# EasyEDA Pro project EasyEDA_ChisFlash_V0.1_Pichu.epro

# Schematic ChisFlash-Pichu
Create Date: 2024-08-13; Page Name: P1; Project Name: GBA烧录卡; Schematic Name: ChisFlash-Prometheus_1; Update Date: 2024-08-13; Company: ChisBread/ChisFlash-Prometheus; Drawed: ChisBread; Page Size: A4; Reviewed: ChisBread; Version: 2
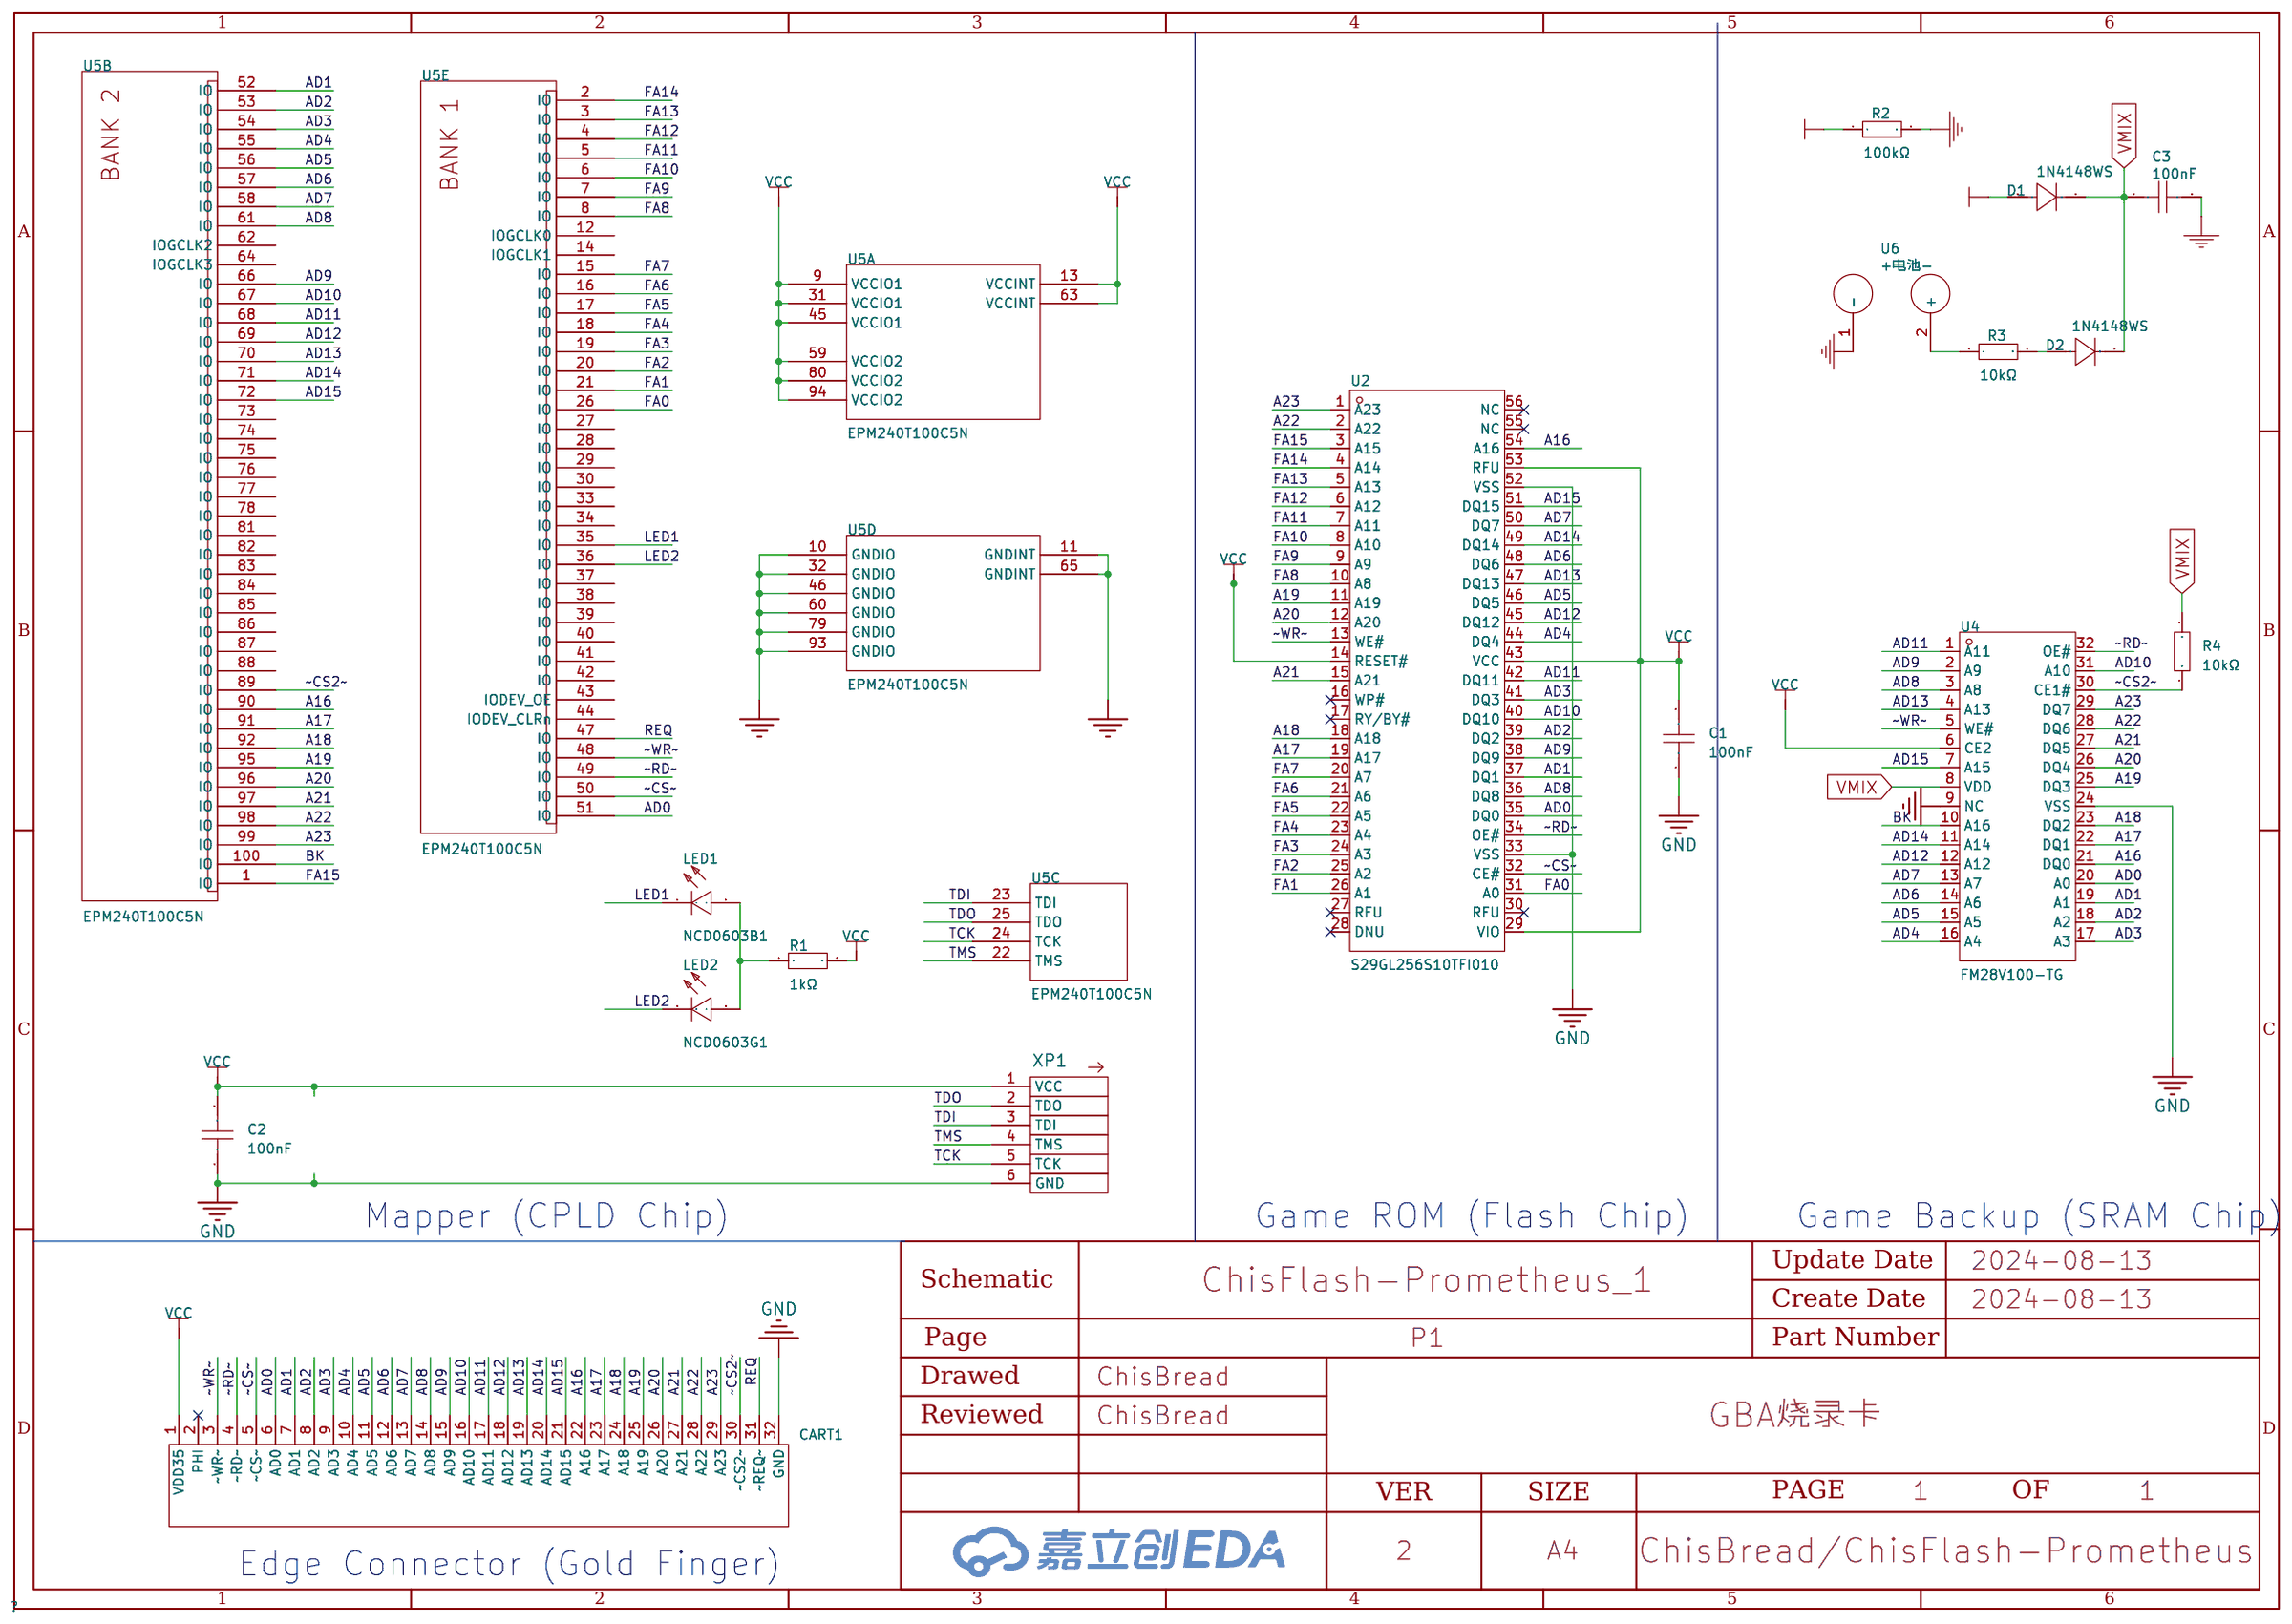
[diagram p0: schematic sheet]

## Parts
C1  100nF  [C0603]
C2  100nF  [C0603]
C3  100nF  [C0603]
CART1  -  [GBACartridge]  (no BOM)
D1  1N4148WS  [SOD-323_L1.8-W1.3-LS2.5-RD]
D2  1N4148WS  [SOD-323_L1.8-W1.3-LS2.5-RD]
LED1  NCD0603B1  [LED0603-RD]
LED2  NCD0603G1  [LED0603-RD]
R1  1kΩ  [R0603]
R2  100kΩ  [R0603]
R3  10kΩ  [R0603]
R4  10kΩ  [R0603]
U2  S29GL256S10TFI010  [TSOP-56_L18.4-W14.0-P0.50-LS20.0-TL]
U4  FM28V100-TG  [STSOP-32_L8.0-W11.8-P0.50-LS13.4-TL]
U5  EPM240T100C5N  [TQFP-100_L14.0-W14.0-P0.50-LS16.0-BL]  (sections 1,2,3,4,5)
U6  +电池-  [电池]
XP1  JTAG  [HDR-TH_6P-P1.27-V-M-1]  (no BOM)

## Library data of the parts
C1 C2 = CAP_0603: Supplier Footprint: 0603
C3 = CGA0603X7R104K500JT: 容值:100nF;精度:±10%;额定电压:50V;材质(温度系数):X7R;; LCSC Part Name: 100nF ±10% 50V; Supplier Part: C6119867; Manufacturer: HRE(芯声); Supplier Footprint: 0603; JLCPCB Part Class: Extended Part; Supplier: LCSC; Tolerance: ±10%; Voltage Rated: 50V; Temperature Coefficient: X7R
CART1 = GBACartridge: GBA Cartridge
D1 D2 = 1N4148WS_C917117: 二极管配置:独立式;正向压降(Vf):1.25V@150mA;直流反向耐压(Vr):100V;平均整流电流(Io):300mA;功率:400mW;反向恢复时间(trr):8ns;; LCSC Part Name: 电压:100V 电流:300mA; Supplier Part: C917117; Manufacturer: JSMSEMI(杰盛微); Supplier Footprint: SOD-323; JLCPCB Part Class: Extended Part; Datasheet: https://atta.szlcsc.com/upload/public/pdf/source/20230807/08D9F448A82EA88A23B325A669586A09.pdf; Supplier: LCSC; Diode Configuration: 独立式; Forward Voltage (Vf@If): 1.25V@150mA; Reverse Voltage (Vr): 100V; Average Rectified Current (Io): 300mA; Power Dissipation: 400mW; Reverse Leakage Current: 1uA@75V; Reverse Recovery Time (trr): 8ns; Operating Temperature: -55℃~+150℃@(Tj)
LED1 = NCD0603B1: 发光颜色:蓝色;正向电压(VF):2.6V~3.6V;功率:72mW;正向电流:10mA;主波长:463nm~475nm;透镜颜色:无色透明透镜;发光强度:80mcd~220mcd;发光角度:130°;工作温度:-30℃~+85℃;; Supplier Part: C84266; Manufacturer: 国星光电; Supplier Footprint: 0603; JLCPCB Part Class: 扩展库; Datasheet: https://atta.szlcsc.com/upload/public/pdf/source/20200820/C84266_6A3CDBEFA72C6CAD68EDA53474ADAE6C.pdf; Supplier: LCSC; Emitted Color: 蓝色; Forward Voltage (VF): 2.6V~3.6V; Power Dissipation: 72mW; Forward Current: 10mA; Dominant Wavelength: 463nm~475nm; Lens Color: 无色透明透镜; Luminous Intensity: 80mcd~220mcd; Viewing Angle: 130°; Operating Temperature: -30℃~+85℃
LED2 = NCD0603G1: 发光颜色:翠绿色;正向电压(VF):2.6V~3.6V;功率:72mW;正向电流:10mA;主波长:515nm~530nm;透镜颜色:无色透明透镜;发光强度:330mcd~900mcd;发光角度:130°;工作温度:-30℃~+85℃;; Supplier Part: C84267; Manufacturer: 国星光电; Supplier Footprint: 0603; JLCPCB Part Class: 扩展库; Datasheet: https://atta.szlcsc.com/upload/public/pdf/source/20200820/C84267_04BA7703640BAC111D09F5EFB971FBF3.pdf; Supplier: LCSC; Emitted Color: 翠绿色; Forward Voltage (VF): 2.6V~3.6V; Power Dissipation: 72mW; Forward Current: 10mA; Dominant Wavelength: 515nm~530nm; Lens Color: 无色透明透镜; Luminous Intensity: 330mcd~900mcd; Viewing Angle: 130°; Operating Temperature: -30℃~+85℃
R1 = 0603WAF1001T5E: 电阻类型:厚膜电阻;阻值:1kΩ;精度:±1%;功率:100mW;最大工作电压:75V;温度系数:±100ppm/℃;; LCSC Part Name: 1kΩ ±1% 100mW 厚膜电阻; Supplier Part: C21190; Manufacturer: UNI-ROYAL(厚声); Supplier Footprint: 0603; JLCPCB Part Class: 基础库; Datasheet: https://atta.szlcsc.com/upload/public/pdf/source/20200306/C422600_1E6D84923E4A46A82E41ADD87F860B5C.pdf; Supplier: LCSC; Type: 厚膜电阻; Tolerance: ±1%; Power(Watts): 100mW; Overload Voltage (Max): 75V; Temperature Coefficient: ±100ppm/℃; Operating Temperature Range: -55℃~+155℃
R2 = 0603WAF1003T5E: 电阻类型:厚膜电阻;阻值:100kΩ;精度:±1%;功率:100mW;最大工作电压:75V;温度系数:±100ppm/℃;; LCSC Part Name: 100kΩ ±1% 100mW 厚膜电阻; Supplier Part: C25803; Manufacturer: UNI-ROYAL(厚声); Supplier Footprint: 0603; JLCPCB Part Class: Basic Part; Datasheet: https://atta.szlcsc.com/upload/public/pdf/source/20200306/C422600_1E6D84923E4A46A82E41ADD87F860B5C.pdf; Supplier: LCSC; Type: 厚膜电阻; Tolerance: ±1%; Power(Watts): 100mW; Overload Voltage (Max): 75V; Temperature Coefficient: ±100ppm/℃; Operating Temperature Range: -55℃~+155℃; Resistance: 47K
R3 R4 = 0603WAF1002T5E: 电阻类型:厚膜电阻;阻值:10kΩ;精度:±1%;功率:100mW;最大工作电压:75V;温度系数:±100ppm/℃;; LCSC Part Name: 厚膜电阻 10kΩ ±1% 100mW; Supplier Part: C25804; Manufacturer: UNI-ROYAL(厚声); Supplier Footprint: 0603; JLCPCB Part Class: Basic Part; Datasheet: https://atta.szlcsc.com/upload/public/pdf/source/20200306/C422600_1E6D84923E4A46A82E41ADD87F860B5C.pdf; Supplier: LCSC; Type: 厚膜电阻; Tolerance: ±1%; Power(Watts): 100mW; Overload Voltage (Max): 75V; Temperature Coefficient: ±100ppm/℃; Operating Temperature Range: -55℃~+155℃; Resistance: 47K
U2 = S29GL256S10TFI010: Supplier Part: C1350995; Manufacturer: SPANSION(飞索); Supplier Footprint: TSOP-56; JLCPCB Part Class: Extended Part; Datasheet: https://atta.szlcsc.com/upload/public/pdf/source/20201109/C914940_4A5E28132C9BE0EE19A790F58F84C86D.pdf; Supplier: LCSC
U4 = FM28V100-TG: Supplier Part: C2959453; Manufacturer: CYPRESS(赛普拉斯); Supplier Footprint: TFSOP-32; JLCPCB Part Class: 扩展库; Datasheet: https://atta.szlcsc.com/upload/public/pdf/source/20210608/2F2AEFEDCE558E0D37969C616959BD3C.pdf; Supplier: LCSC
U5 = EPM240T100C5N: 类型:其它PLD;逻辑门数量:-;逻辑单元数:-;逻辑阵列块数:240;; Supplier Part: C10041; Manufacturer: Intel/Altera; Supplier Footprint: TQFP-100(14x14); JLCPCB Part Class: 扩展库; Datasheet: https://atta.szlcsc.com/upload/public/pdf/source/20121123/1457706563537.pdf; Supplier: LCSC; Type: 其它PLD; Supply Voltage Range - VCCIO: 3.3V；2.5V; Logic Array Blocks: 240; Maximum Delay Time Tpd: 4.7ns; Operating Temperature Range: 0℃~+85℃
U6 = +电池-
XP1 = jtag

## Nets
GND: C1.1 C2.1 C3.2 CART1.32(GND) R2.2 U2.33(VSS) U2.52(VSS) U4.9(NC) U4.24(VSS) U5.10(GNDIO) U5.11(GNDINT) U5.32(GNDIO) U5.46(GNDIO) U5.60(GNDIO) U5.65(GNDINT) U5.79(GNDIO) U5.93(GNDIO) U6.1(-) XP1.6(GND)
VCC: C1.2 C2.2 CART1.1(VDD35) D1.2(A) R1.2 R2.1 U2.14(RESET#) U2.29(VIO) U2.43(VCC) U2.53(RFU) U4.6(CE2) U5.9(VCCIO1) U5.13(VCCINT) U5.31(VCCIO1) U5.45(VCCIO1) U5.59(VCCIO2) U5.63(VCCINT) U5.80(VCCIO2) U5.94(VCCIO2) XP1.1(VCC)
A16: CART1.22(A16) U2.54(A16) U4.21(DQ0) U5.90(IO)
A17: CART1.23(A17) U2.19(A17) U4.22(DQ1) U5.91(IO)
A18: CART1.24(A18) U2.18(A18) U4.23(DQ2) U5.92(IO)
A19: CART1.25(A19) U2.11(A19) U4.25(DQ3) U5.95(IO)
A20: CART1.26(A20) U2.12(A20) U4.26(DQ4) U5.96(IO)
A21: CART1.27(A21) U2.15(A21) U4.27(DQ5) U5.97(IO)
A22: CART1.28(A22) U2.2(A22) U4.28(DQ6) U5.98(IO)
A23: CART1.29(A23) U2.1(A23) U4.29(DQ7) U5.99(IO)
AD0: CART1.6(AD0) U2.35(DQ0) U4.20(A0) U5.51(IO)
AD1: CART1.7(AD1) U2.37(DQ1) U4.19(A1) U5.52(IO)
AD2: CART1.8(AD2) U2.39(DQ2) U4.18(A2) U5.53(IO)
AD3: CART1.9(AD3) U2.41(DQ3) U4.17(A3) U5.54(IO)
AD4: CART1.10(AD4) U2.44(DQ4) U4.16(A4) U5.55(IO)
AD5: CART1.11(AD5) U2.46(DQ5) U4.15(A5) U5.56(IO)
AD6: CART1.12(AD6) U2.48(DQ6) U4.14(A6) U5.57(IO)
AD7: CART1.13(AD7) U2.50(DQ7) U4.13(A7) U5.58(IO)
AD8: CART1.14(AD8) U2.36(DQ8) U4.3(A8) U5.61(IO)
AD9: CART1.15(AD9) U2.38(DQ9) U4.2(A9) U5.66(IO)
AD10: CART1.16(AD10) U2.40(DQ10) U4.31(A10) U5.67(IO)
AD11: CART1.17(AD11) U2.42(DQ11) U4.1(A11) U5.68(IO)
AD12: CART1.18(AD12) U2.45(DQ12) U4.12(A12) U5.69(IO)
AD13: CART1.19(AD13) U2.47(DQ13) U4.4(A13) U5.70(IO)
AD14: CART1.20(AD14) U2.49(DQ14) U4.11(A14) U5.71(IO)
AD15: CART1.21(AD15) U2.51(DQ15) U4.7(A15) U5.72(IO)
BK: U4.10(A16) U5.100(IO)
FA0: U2.31(A0) U5.26(IO)
FA1: U2.26(A1) U5.21(IO)
FA2: U2.25(A2) U5.20(IO)
FA3: U2.24(A3) U5.19(IO)
FA4: U2.23(A4) U5.18(IO)
FA5: U2.22(A5) U5.17(IO)
FA6: U2.21(A6) U5.16(IO)
FA7: U2.20(A7) U5.15(IO)
FA8: U2.10(A8) U5.8(IO)
FA9: U2.9(A9) U5.7(IO)
FA10: U2.8(A10) U5.6(IO)
FA11: U2.7(A11) U5.5(IO)
FA12: U2.6(A12) U5.4(IO)
FA13: U2.5(A13) U5.3(IO)
FA14: U2.4(A14) U5.2(IO)
FA15: U2.3(A15) U5.1(IO)
LED1: LED1.1(-) U5.35(IO)
LED2: LED2.1(K) U5.36(IO)
REQ: CART1.31(~REQ~) U5.47(IO)
TCK: U5.24(TCK) XP1.5(TCK)
TDI: U5.23(TDI) XP1.3(TDI)
TDO: U5.25(TDO) XP1.2(TDO)
TMS: U5.22(TMS) XP1.4(TMS)
VMIX: C3.1 D1.1(C) D2.1(C) R4.2 U4.8(VDD)
~CS2~: CART1.30(~CS2~) R4.1 U4.30(CE1#) U5.89(IO)
~CS~: CART1.5(~CS~) U2.32(CE#) U5.50(IO)
~RD~: CART1.4(~RD~) U2.34(OE#) U4.32(OE#) U5.49(IO)
~WR~: CART1.3(~WR~) U2.13(WE#) U4.5(WE#) U5.48(IO)
$1N77583: LED1.2(+) LED2.2(A) R1.1
$1N81263: D2.2(A) R3.2
$1N81264: R3.1 U6.2(+)

Not connected (* = marked no-connect by the designer): CART1 2(PHI)*; U2 16(WP#)* 17(RY/BY#)* 27(RFU)* 28(DNU)* 30(RFU)* 55(NC)* 56(NC)*; U5 12(IOGCLK0) 14(IOGCLK1) 27(IO) 28(IO) 29(IO) 30(IO) 33(IO) 34(IO) 37(IO) 38(IO) 39(IO) 40(IO) 41(IO) 42(IO) 43(IODEV_OE) 44(IODEV_CLRn) 62(IOGCLK2) 64(IOGCLK3) 73(IO) 74(IO) 75(IO) 76(IO) 77(IO) 78(IO) 81(IO) 82(IO) 83(IO) 84(IO) 85(IO) 86(IO) 87(IO) 88(IO)

## Notes on the sheet
- Mapper (CPLD Chip)
- Game ROM (Flash Chip)
- Game Backup (SRAM Chip)
- Edge Connector (Gold Finger)

# Board ChisFlash-Pichu
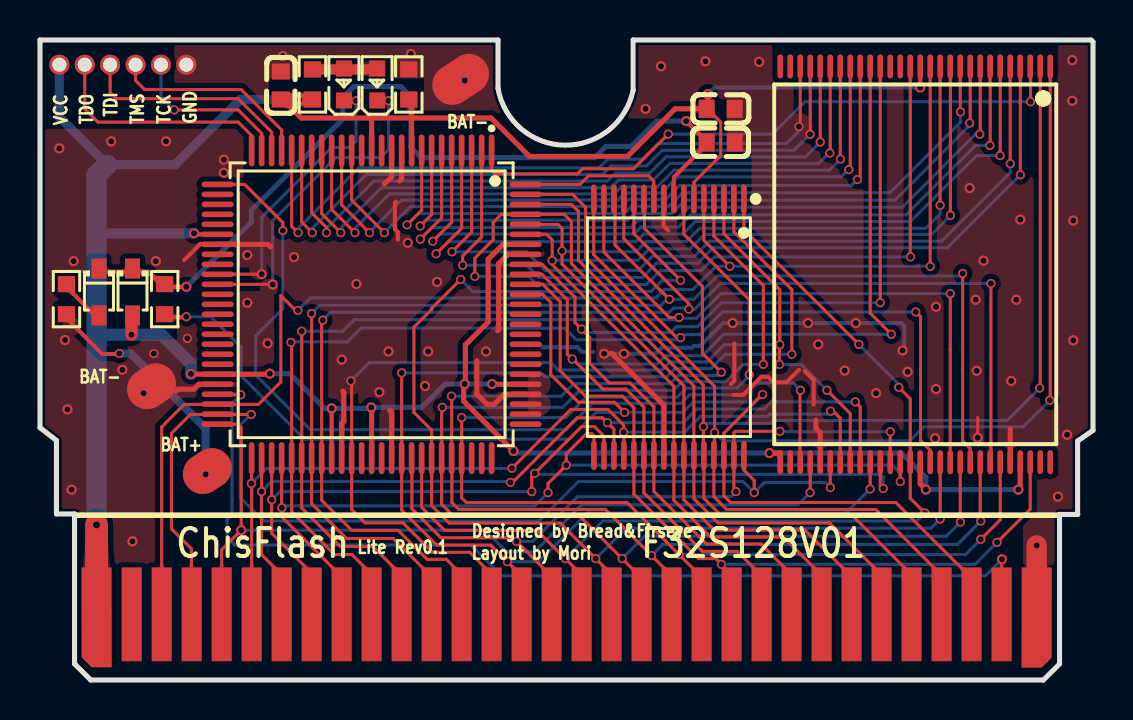
[diagram p1: board, top side]
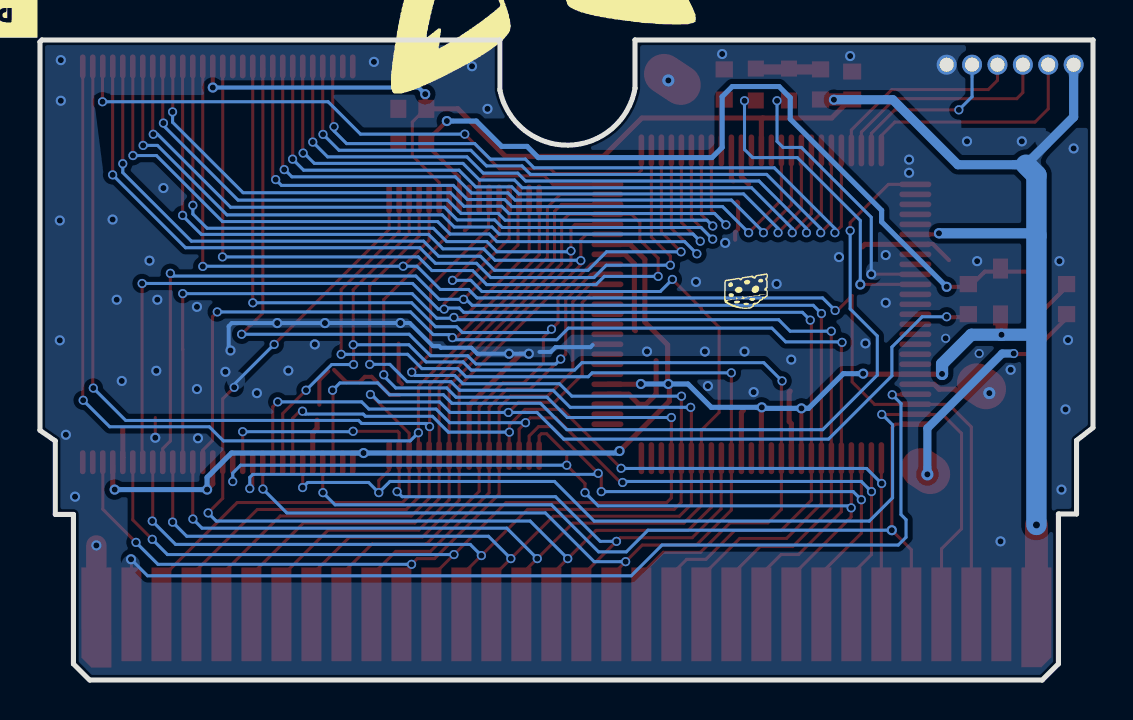
[diagram p2: board, bottom side, seen from below]

Outline 52.66 x 32.03 mm; copper layers: Top Layer, Bottom Layer. Coordinates in mm from the lower left corner of the outline.
Outline path: 50.16,0 2.54,0 1.73,0.81 1.73,8.31 0.82,8.31 0.82,11.98 0,12.63 0,32.03 22.9,32.03 22.9,29.6 arc(26.24,26.76) 29.66,29.51 29.66,32.03 52.56,32.03 52.66,31.93 52.66,12.49 51.89,11.96 51.89,8.29 50.98,8.29 50.98,0.81 50.18,0
Stack: Top Layer 0.035mm - / Dielectric1 1.51mm FR4 er 4.5 / Bottom Layer 0.035mm -

## Design rules (mm)
template: 自定义配置
spacing copperThickness1oz (default): track to track 0.152, other pairs 0.152 to 0.3
spacing copperThickness2oz: track to track 0.152, other pairs 0.152 to 0.3
track width copperThickness1oz (default): min 0.152, default 0.203, max 2.54
track width copperThickness2oz: min 0.152, default 0.254, max 2.54
differential pair differentialPair (default): width min 0.152, default 0.254, max 2.54; gap min 0.152, default 0.152
via viaSize (default): diameter min 0.406, default 0.508, max 10; hole min 0.305, default 0.305, max 6.299

## Placement (name value [footprint] x y rotation side)
C1  100nF  [C0603]  34.04 28.58 180 top
C2  100nF  [C0603]  12.04 29.75 270 top
C3  100nF  [C0603]  34.04 26.9 0 top
CART1  -  [GBACartridge]  26.31 18.09 0 top
D1  1N4148WS  [SOD-323_L1.8-W1.3-LS2.5-RD]  4.63 19.42 270 top
D2  1N4148WS  [SOD-323_L1.8-W1.3-LS2.5-RD]  2.95 19.42 270 top
LED1  NCD0603B1  [LED0603-RD]  15.2 29.8 90 top
LED2  NCD0603G1  [LED0603-RD]  16.86 29.8 90 top
NOREF  -  [Pad_e80923]  21.03 30.05 33.3 top
R1  1kΩ  [R0603]  13.62 29.8 270 top
R2  100kΩ  [R0603]  18.44 29.8 90 top
R3  10kΩ  [R0603]  1.32 19.06 90 top
R4  10kΩ  [R0603]  6.23 19.06 90 top
U2  S29GL256S10TFI010  [TSOP-56_L18.4-W14.0-P0.50-LS20.0-TL]  43.77 20.8 270 top
U4  FM28V100-TG  [STSOP-32_L8.0-W11.8-P0.50-LS13.4-TL]  31.45 17.65 270 top
U5  EPM240T100C5N  [TQFP-100_L14.0-W14.0-P0.50-LS16.0-BL]  16.58 18.8 180 top
U6  +电池-  [电池]  5.58 14.7 303.3 top
XP1  JTAG  [HDR-TH_6P-P1.27-V-M-1]  4.14 30.79 0 top

## Footprints (pads in the part's own frame, mm; a bottom-side part is the same pattern mirrored in y, then rotated)
C0603
  rect 0.8x0.9 smd: 1(-0.7,0) 2(0.7,0)
GBACartridge
  custom 1.509x4.995 smd: 1(-23.479,-14.958)
  custom 1x4.691 smd: 2(-21.724,-14.806) 3(-20.224,-14.806) 4(-18.724,-14.806) 5(-17.224,-14.806) 6(-15.725,-14.806) 7(-14.225,-14.806) 8(-12.725,-14.806) 9(-11.225,-14.806) 10(-9.725,-14.806) 11(-8.225,-14.806) 12(-6.724,-14.806) 13(-5.224,-14.806) 14(-3.724,-14.806) 15(-2.224,-14.806) 16(-0.725,-14.806) 17(0.775,-14.806) 18(2.276,-14.806) 19(3.776,-14.806) 20(5.276,-14.806) 21(6.776,-14.806) 22(8.275,-14.806) 23(9.775,-14.806) 24(11.275,-14.806) 25(12.775,-14.806) 26(14.275,-14.806) 27(15.775,-14.806) 28(17.276,-14.806) 29(18.776,-14.806) 30(20.276,-14.806) 31(21.776,-14.806)
  custom 1.506x5.012 smd: 32(23.529,-14.966)
HDR-TH_6P-P1.27-V-M-1
  round 1 hole 0.7: 1(-3.175,0) 2(-1.905,0) 3(-0.635,0) 4(0.635,0) 5(1.905,0) 6(3.175,0)
LED0603-RD
  rect 0.8x0.8 smd: 1(-0.799,0) 2(0.799,0)
Pad_e80923
  oval 3x2 smd: 2(0,0)
R0603
  rect 0.806x0.864 smd: 1(-0.753,0) 2(0.753,0)
SOD-323_L1.8-W1.3-LS2.5-RD
  rect 1x0.75 smd: 1(-1.173,0) 2(1.173,0)
STSOP-32_L8.0-W11.8-P0.50-LS13.4-TL
  oval 1.44x0.28 smd: 1(-6.42,3.75) 2(-6.42,3.25) 3(-6.42,2.75) 4(-6.42,2.25) 5(-6.42,1.75) 6(-6.42,1.25) 7(-6.42,0.75) 8(-6.42,0.25) 9(-6.42,-0.25) 10(-6.42,-0.75) 11(-6.42,-1.25) 12(-6.42,-1.75) 13(-6.42,-2.25) 14(-6.42,-2.75) 15(-6.42,-3.25) 16(-6.42,-3.75) 17(6.42,-3.75) 18(6.42,-3.25) 19(6.42,-2.75) 20(6.42,-2.25) 21(6.42,-1.75) 22(6.42,-1.25) 23(6.42,-0.75) 24(6.42,-0.25) 25(6.42,0.25) 26(6.42,0.75) 27(6.42,1.25) 28(6.42,1.75) 29(6.42,2.25) 30(6.42,2.75) 31(6.42,3.25) 32(6.42,3.75)
TQFP-100_L14.0-W14.0-P0.50-LS16.0-BL
  oval 0.28x1.6 smd: 1(-6,-7.7) 2(-5.5,-7.7) 3(-5,-7.7) 4(-4.5,-7.7) 5(-4,-7.7) 6(-3.5,-7.7) 7(-3,-7.7) 8(-2.5,-7.7) 9(-2,-7.7) 10(-1.5,-7.7) 11(-1,-7.7) 12(-0.5,-7.7) 13(0,-7.7) 14(0.5,-7.7) 15(1,-7.7) 16(1.5,-7.7) 17(2,-7.7) 18(2.5,-7.7) 19(3,-7.7) 20(3.5,-7.7) 21(4,-7.7) 22(4.5,-7.7) 23(5,-7.7) 24(5.5,-7.7) 25(6,-7.7) 51(6,7.7) 52(5.5,7.7) 53(5,7.7) 54(4.5,7.7) 55(4,7.7) 56(3.5,7.7) 57(3,7.7) 58(2.5,7.7) 59(2,7.7) 60(1.5,7.7) 61(1,7.7) 62(0.5,7.7) 63(0,7.7) 64(-0.5,7.7) 65(-1,7.7) 66(-1.5,7.7) 67(-2,7.7) 68(-2.5,7.7) 69(-3,7.7) 70(-3.5,7.7) 71(-4,7.7) 72(-4.5,7.7) 73(-5,7.7) 74(-5.5,7.7) 75(-6,7.7)
  oval 1.6x0.28 smd: 26(7.7,-6) 27(7.7,-5.5) 28(7.7,-5) 29(7.7,-4.5) 30(7.7,-4) 31(7.7,-3.5) 32(7.7,-3) 33(7.7,-2.5) 34(7.7,-2) 35(7.7,-1.5) 36(7.7,-1) 37(7.7,-0.5) 38(7.7,0) 39(7.7,0.5) 40(7.7,1) 41(7.7,1.5) 42(7.7,2) 43(7.7,2.5) 44(7.7,3) 45(7.7,3.5) 46(7.7,4) 47(7.7,4.5) 48(7.7,5) 49(7.7,5.5) 50(7.7,6) 76(-7.7,6) 77(-7.7,5.5) 78(-7.7,5) 79(-7.7,4.5) 80(-7.7,4) 81(-7.7,3.5) 82(-7.7,3) 83(-7.7,2.5) 84(-7.7,2) 85(-7.7,1.5) 86(-7.7,1) 87(-7.7,0.5) 88(-7.7,0) 89(-7.7,-0.5) 90(-7.7,-1) 91(-7.7,-1.5) 92(-7.7,-2) 93(-7.7,-2.5) 94(-7.7,-3) 95(-7.7,-3.5) 96(-7.7,-4) 97(-7.7,-4.5) 98(-7.7,-5) 99(-7.7,-5.5) 100(-7.7,-6)
TSOP-56_L18.4-W14.0-P0.50-LS20.0-TL
  oval 1.199x0.28 smd: 1(-9.901,6.752) 2(-9.901,6.251) 3(-9.901,5.75) 4(-9.901,5.25) 5(-9.901,4.75) 6(-9.901,4.25) 7(-9.901,3.749) 8(-9.901,3.251) 9(-9.901,2.751) 10(-9.901,2.251) 11(-9.901,1.75) 12(-9.901,1.25) 13(-9.901,0.75) 14(-9.901,0.249) 15(-9.901,-0.249) 16(-9.901,-0.75) 17(-9.901,-1.25) 18(-9.901,-1.75) 19(-9.901,-2.251) 20(-9.901,-2.751) 21(-9.901,-3.248) 22(-9.901,-3.749) 23(-9.901,-4.25) 24(-9.901,-4.75) 25(-9.901,-5.25) 26(-9.901,-5.75) 27(-9.901,-6.251) 28(-9.901,-6.749) 29(9.901,-6.749) 30(9.901,-6.251) 31(9.901,-5.75) 32(9.901,-5.25) 33(9.901,-4.75) 34(9.901,-4.25) 35(9.901,-3.749) 36(9.901,-3.248) 37(9.901,-2.751) 38(9.901,-2.251) 39(9.901,-1.75) 40(9.901,-1.25) 41(9.901,-0.75) 42(9.901,-0.249) 43(9.901,0.249) 44(9.901,0.75) 45(9.901,1.25) 46(9.901,1.75) 47(9.901,2.251) 48(9.901,2.751) 49(9.901,3.251) 50(9.901,3.749) 51(9.901,4.25) 52(9.901,4.75) 53(9.901,5.25) 54(9.901,5.75) 55(9.901,6.251) 56(9.901,6.752)
电池
  oval 2x2.54 smd: 1(0,0) 2(5.08,0)

## Nets
As in the schematic, except:
GND: C1.1 C2.1 C3.2 CART1.32 NOREF.2 R2.2 U2.33 U2.52 U4.9 U4.24 U5.10 U5.11 U5.32 U5.46 U5.60 U5.65 U5.79 U5.93 U6.1 XP1.6

Pads without a net: CART1 2; U2 16 17 27 28 30 55 56; U5 12 14 27 28 29 30 33 34 37 38 39 40 41 42 43 44 62 64 73 74 75 76 77 78 81 82 83 84 85 86 87 88

## Via types
v1: diameter 0.457, hole 0.305, Top Layer to Bottom Layer, 125 vias
v2: diameter 0.508, hole 0.305, Top Layer to Bottom Layer, 80 vias
v3: diameter 0.711, hole 0.355, Top Layer to Bottom Layer, 1 via
v4: diameter 0.61, hole 0.305, Top Layer to Bottom Layer, 3 vias

## Routing (per net, layer and track width the routed paths; a pad name or vN(x,y) marks a point on that pad's centre or on a via; arc(x,y) is an arc through that point)
GND: length 71.6
  Top Layer w0.152: v2(46.89,12.12) 46.89,13.14
  Top Layer w0.203: 7.2,21.01 8.02,21.82 8.27,21.82 ; 34.69,14.27 35.16,14.27 36.07,15.17 36.41,15.17 36.68,14.9 37.33,14.9 37.95,15.52 ; 34.72,16.83 34.72,14.97 34.55,14.81 ; 38.24,15.46 38.69,15.01 38.69,13.78 ; 17.9,22.03 17.9,22.41 17.75,22.56 17.75,23.89 17.8,23.94 ; 31.18,23.57 31.18,22.73 31.41,22.5
  Top Layer w0.254: U5.65 17.58,13.39 17.48,13.49 ; 17.99,24.97 18.08,25.07 U5.10 ; U5.32 11.4,21.8 11.53,21.67 ; U5.93 23.41,21.3 22.93,20.83 22.93,17.52 22.88,17.47 ; 21.85,15.98 21.85,14.3 22.35,13.8 22.71,13.8 23.21,14.3 U5.79 ; U5.11 17.58,25.18 17.22,24.82 ; 15.14,14.46 15.19,14.41 15.19,12.93 15.08,12.82 U5.60 ; 6.81,14.46 6.91,14.55 7.7,14.55 7.94,14.8 U5.46 ; 48.52,10.52 48.52,12.58 ; 39.02,10.52 39.02,12.37 38.8,12.59 38.8,13 ; v2(28.21,16.33) 28.61,16.33 31.2,13.74 31.2,11.36
  Top Layer w1.016: CART1.32 v2(49.84,6.73)
  Bottom Layer w0.203: v2(43.13,16.49) 43.22,16.58 43.22,17.7 43.07,17.86 v2(40.79,17.86) v2(38.41,17.86) 38.4,17.86 v2(34.64,17.86) 34.16,17.86 33.01,16.71 32.7,16.71 32.61,16.63 31.09,16.63 30.79,16.33 v2(29.2,16.33) v2(28.21,16.33) ; 27.68,16.42 27.11,16.42 26.88,16.66 25.13,16.66 25.02,16.76
  vias: v1(5.69,16.34) v1(7.37,17.1) v2(0.97,26.6) v2(1.25,17.01) v2(1.37,13.54) v2(1.58,9.53) v2(1.68,20.96) v2(3.56,26.95) v2(4.12,15.52) v2(4.63,6.94) v2(5.79,20.96) v2(6.3,26.95) v2(9.2,26.04) v2(9.2,25.38) v2(10.37,21.26) v2(10.37,18.88) v2(11.38,16.84) v2(12.14,31.22) v2(12.7,21.16) v2(15.09,16.03) v2(15.82,19.82) v2(16.97,14.41) v2(17.43,16.44) v2(18.39,21.87) v2(18.54,31.32) v2(19.26,14.71) v2(19.41,16.44) v2(19.85,19.92) v2(22.3,16.44) v2(30.28,28.58) v2(31.05,30.71) v2(33.27,30.96) v2(35.96,30.93) v2(38.92,16.79) v2(40.24,15.48) v2(41.81,14.36) v2(43.39,15.42) v2(44.76,12.1) v2(44.81,18.67) v2(44.81,14.56) v2(46.48,24.62) v2(46.79,19.03) v2(46.84,15.47) v2(47.18,20.98) v2(48.57,14.97) v2(48.82,19.03) v2(49.02,23.04) v2(50.9,9.17) v2(51.36,12.27) v2(51.61,31.02) v2(51.61,28.99) v2(51.67,22.99) v2(51.67,17) v4(5.18,14.36) v4(21.24,30)
VCC: length 164.8
  Top Layer w0.152: 32.7,24.1 32.7,24.9 34.04,26.24 34.04,27.92 33.48,28.48 33.34,28.48
  Top Layer w0.203: v2(7.7,22.35) 7.76,22.3 U5.31 ; 14.58,13.59 U5.59 ; v2(44.02,29.65) U2.14
  Top Layer w0.254: 44.02,10.73 44.02,9.81 v2(44.3,9.53) ; v2(11.49,15.33) 11.46,15.3 U5.45 7.57,15.3 ; U5.94 23.16,21.8 22.41,21.05 22.41,17.91 21.27,16.77 21.27,14.85 v2(21.24,14.81) 21.19,14.76 21.19,13.95 v2(23.67,11.46) ; v2(16.56,13.64) 16.58,13.62 U5.63 ; v2(48.92,9.53) 49.02,9.62 49.02,10.73 ; v2(33.39,29.31) 33.39,28.58 31.76,28.58 29.38,26.2 24.48,26.2 22.56,28.12 18.58,28.12 ; U5.80 22.6,14.8 v2(22.61,14.81) ; 18.54,29.05 18.58,29 18.58,28.12 ; 16.51,28.12 16.58,28.05 U5.13 ; 16.51,28.12 13.07,28.12 12.14,29.05 ; 16.51,28.12 18.58,28.12 ; 18.58,28.12 U5.9 ; 37.02,10.52 37.02,11.36 v2(36.48,11.36)
  Top Layer w0.61: 13.73,29.05 13.72,29.05 12.14,29.05 ; v2(4.57,17.28) 4.57,18.09
  Top Layer w1.143: 2.72,4.72 2.83,4.83 v3(2.83,7.76)
  Bottom Layer w0.203: v2(44.02,29.65) 33.72,29.65 v2(33.39,29.31)
  Bottom Layer w0.254: v2(48.92,9.53) v2(44.3,9.53) 44.3,10.14 43.08,11.36 v2(36.48,11.36) 23.78,11.36 v2(23.67,11.46) ; v2(22.61,14.81) v2(21.24,14.81) 20.26,14.81 19.09,13.64 v2(16.56,13.64) 16.51,13.59 v2(14.58,13.59) 14.22,13.59 12.49,15.33 v2(11.49,15.33)
  Bottom Layer w0.457: XP1.1 0.97,28.17 3.36,25.78 6.76,25.78 10.01,29.04 v2(12.96,29.04)
  Bottom Layer w0.508: 2.83,22.23 2.95,22.35 v2(7.7,22.35)
  Bottom Layer w0.61: 2.83,17.28 v2(4.57,17.28) 6.09,17.28 7.55,15.81 7.55,15.32 v2(7.55,15.31)
  Bottom Layer w1.016: 3.36,25.78 2.83,25.26 v3(2.83,7.76)
A16: length 41.6
  Top Layer w0.152: U5.90 25.14,19.8 26.01,18.93 26.01,15.47 27.28,14.2 29.12,14.2 29.7,13.63 29.7,9.3 32.93,6.08 33.79,6.08 v1(34.08,5.79) 34.08,5.77 34.58,5.26 CART1.22 ; v1(47.86,6.89) 49.52,8.55 49.52,10.73
  Bottom Layer w0.152: v1(34.08,5.79) 46.76,5.79 v1(47.86,6.89)
A17: length 54.5
  Top Layer w0.152: 41.45,30.59 41.51,30.53 41.51,18.36 v1(42.57,17.3) ; CART1.23 36.08,5.22 34.86,6.44 33.13,6.44 30.2,9.37 30.2,13.66 29.29,14.56 28.15,14.56 26.65,16.06 v1(26.62,16.06) 26.37,16.31 26.37,19.03 25.1,20.3 U5.91
  Bottom Layer w0.152: v1(42.57,17.3) 34.2,17.3 33.12,16.23 31.27,16.23 30.86,15.81 26.86,15.81 v1(26.62,16.06)
A18: length 53
  Top Layer w0.152: CART1.24 37.58,5.27 36.05,6.81 33.33,6.81 30.7,9.44 30.7,13.67 29.5,14.86 28.47,14.86 27.48,15.85 27.48,17.15 v1(27.08,17.56) 26.75,17.88 26.75,19.15 25.1,20.81 24.29,20.81 U5.92 ; 42.02,30.53 42.02,18.88 v1(42.01,18.88)
  Bottom Layer w0.152: v1(42.01,18.88) 34.07,18.88 32.88,17.68 31.82,17.68 31.53,17.39 27.25,17.39 v1(27.08,17.56)
A19: length 56
  Top Layer w0.152: CART1.25 39.08,5.25 37.18,7.15 33.53,7.15 31.7,8.99 31.7,14.7 25.61,20.78 v1(25.61,20.99) 25.61,22.02 25.33,22.3 U5.95 ; v1(45.52,23.25) 45.52,30.52 45.52,30.53
  Bottom Layer w0.152: v1(25.61,20.99) 25.63,21 29.9,21 30.47,21.58 32.5,21.58 33.23,22.3 44.59,22.3 45.52,23.23 v1(45.52,23.25)
A20: length 56.8
  Top Layer w0.152: v1(45.01,23.75) 45.01,30.52 45.02,30.53 ; U5.96 25.9,22.8 26.11,22.59 v1(26.11,21.47) 26.11,20.82 32.2,14.72 32.2,9.02 33.71,7.5 38.25,7.5 40.58,5.17 CART1.26
  Bottom Layer w0.152: v1(26.11,21.47) 26.14,21.43 29.8,21.43 30.31,21.94 32.32,21.94 32.98,22.6 44.3,22.6 45.01,23.32 v1(45.01,23.75)
A21: length 66.7
  Top Layer w0.152: 43.52,30.53 43.52,21.19 v1(43.53,21.17) ; 42.14,5.2 39.49,7.86 33.91,7.86 32.7,9.07 32.7,14.71 26.57,20.84 26.57,22.94 26.21,23.3 U5.97 23.07,23.3 22.66,22.89 22.66,22.03 21.74,21.11 v1(21.74,20.2)
  Bottom Layer w0.152: 43.53,21.17 33.74,21.17 33.06,20.49 31.02,20.49 30.32,19.79 24.85,19.79 24.44,20.2 v1(21.74,20.2)
A22: length 67.2
  Top Layer w0.152: U5.98 26.57,23.8 26.93,23.45 26.93,21 33.17,14.75 v1(33.17,12.68) 33.17,11.39 33.2,11.36 33.2,9.1 34.09,8.21 40.64,8.21 43.58,5.27 CART1.28 ; v1(49.99,14.61) 50.02,14.64 50.02,30.53
  Bottom Layer w0.152: v1(33.17,12.68) 33.33,12.84 36.57,12.84 36.72,12.99 48.37,12.99 v1(49.99,14.61)
A23: length 67.8
  Top Layer w0.152: 45.09,5.23 41.79,8.53 34.34,8.53 33.7,9.17 33.7,11.36 33.73,11.4 v1(33.73,12.37) 33.73,14.69 27.28,21.14 27.28,23.65 26.63,24.3 U5.99 ; 50.52,30.53 50.52,14.02 v1(50.5,14)
  Bottom Layer w0.152: v1(50.5,14) 49.17,12.67 44.19,12.67 43.49,11.97 34.14,11.97 v1(33.73,12.37)
AD0: length 43.2
  Top Layer w0.152: v1(23.6,10.59) 26.55,13.54 28.4,13.54 29.18,12.76 v1(29.18,12.4) 29.2,12.39 29.2,11.41 ; 40.02,10.73 40.02,13.1 39.67,13.45 v1(39.53,13.45) ; 10.58,10.9 CART1.6
  Bottom Layer w0.152: v1(29.18,12.4) 32.24,12.4 33.03,13.2 36.38,13.2 36.49,13.31 39.39,13.31 v1(39.53,13.45) ; v1(10.57,9.83) 11.32,10.59 23.59,10.59 v1(23.6,10.59)
AD1: length 44.9
  Top Layer w0.152: U5.52 11.08,11.09 v1(11.08,9.43) 11.08,6.28 12.08,5.27 CART1.7 ; 28.7,11.41 28.7,12.55 v1(28.38,12.88) 28.13,13.12 26.86,13.12 23.62,9.88 v1(23.52,9.88) ; 41.02,10.73 41.02,13.67 v1(40.77,13.92)
  Bottom Layer w0.152: v1(40.77,13.92) 36.57,13.92 36.21,13.56 32.85,13.56 32.17,12.88 v1(28.38,12.88) ; v1(23.52,9.88) 23.47,9.94 11.58,9.94 v1(11.08,9.43)
AD2: length 47.5
  Top Layer w0.152: CART1.8 13.58,5.34 11.58,7.35 U5.53 ; 28.2,11.41 28.2,12.21 27.73,12.68 27.08,12.68 v1(24.74,10.34) 24.59,10.19 v1(24.59,9.43) ; v1(42.17,9.58) 42.02,9.73 42.02,10.73
  Bottom Layer w0.152: v1(11.58,9.02) 11.99,9.43 v1(24.59,9.43) ; v1(24.74,10.34) 24.79,10.29 42.01,10.29 42.17,10.14 v1(42.17,9.58)
AD3: length 45.8
  Top Layer w0.152: U5.54 12.08,8.62 v1(12.09,8.61) 12.09,8.16 14.94,5.31 14.94,3.43 CART1.9 ; v1(43.02,9.93) 43.02,10.73 ; v1(25.4,9.38) 25.4,9.83 v1(26.32,10.75) 26.32,11.32 27.32,12.32 27.59,12.32 27.7,12.21 27.7,11.36
  Bottom Layer w0.152: v1(12.09,8.61) 12.19,8.72 24.74,8.72 v1(25.4,9.38) ; v1(43.02,9.93) 43.02,10.35 42.62,10.75 v1(26.32,10.75)
AD4: length 65.2
  Top Layer w0.152: 44.52,10.73 44.52,11.5 44.03,11.98 44.03,18.18 v1(43.79,18.42) ; v1(32.04,17.13) 31.84,17.13 27.69,21.28 27.69,24.26 ; v1(12.55,16.89) 12.58,16.86 U5.55 12.58,8.42 14.72,6.28 15.6,6.28 16.51,5.36 16.51,3.36 CART1.10
  Bottom Layer w0.152: v1(12.55,16.89) 12.58,16.92 15.37,16.92 16.05,17.61 26.23,17.61 26.81,17.03 31.93,17.03 v1(32.04,17.13) 32.19,17.28 32.99,17.28 34.13,18.42 v1(43.79,18.42)
AD5: length 67
  Top Layer w0.152: 28.2,24.25 28.2,21.41 31.47,18.14 v1(31.96,18.14) ; v1(13.09,17.45) 13.09,11.1 U5.56 13.08,8.61 15.02,6.68 16.64,6.68 18.04,5.28 18.04,3.34 CART1.11 ; 45.52,10.73 45.52,16.55 45.52,16.55 v1(45.52,19.33)
  Bottom Layer w0.152: v1(13.09,17.45) 15.14,17.45 15.72,18.03 31.84,18.03 v1(31.96,18.14) 32,18.1 32.81,18.1 34.04,19.33 v1(45.52,19.33)
AD6: length 68.5
  Top Layer w0.152: v1(13.58,18.34) 13.58,18.33 U5.57 13.58,8.83 15.32,7.08 17.66,7.08 19.58,5.16 CART1.12 ; 46.52,10.73 46.52,11.58 46.14,11.96 v1(46.14,20.35) ; 28.65,24.3 28.76,24.2 28.76,21.77 v1(31.47,19.05)
  Bottom Layer w0.152: v1(46.14,20.35) 46,20.21 33.86,20.21 32.7,19.05 v1(31.47,19.05) 31.35,19.05 31.05,18.75 13.99,18.75 v1(13.58,18.34)
AD7: length 67.9
  Top Layer w0.152: 47.52,10.73 47.55,10.76 v1(47.55,19.84) ; v1(14.14,18.01) 14.08,17.95 U5.58 14.08,9 15.59,7.49 17.91,7.49 19.36,6.04 20.32,6.04 21.06,5.3 ; v1(32.45,18.56) 32.45,18.83 29.2,22.08 29.2,24.25
  Bottom Layer w0.152: v1(14.14,18.01) 14.53,18.4 31.47,18.4 31.68,18.61 32.39,18.61 v1(32.45,18.56) 32.74,18.56 34.02,19.84 v1(47.55,19.84)
AD8: length 54
  Top Layer w0.152: 22.45,5.36 22.45,5.43 21.49,6.39 19.62,6.39 18.15,7.87 16.26,7.87 15.58,8.54 U5.61 15.58,14.93 v1(15.55,14.97) ; 40.52,10.73 40.52,13.34 v1(39.35,14.5) ; v1(36.98,15.79) 36.98,16.76 v1(36.99,16.78) 36.99,19.53 34.2,22.32 34.2,24.25
  Bottom Layer w0.152: v1(36.98,15.79) 38.07,15.79 v1(39.35,14.5) ; v1(15.55,14.97) 16.46,15.88 25.55,15.88 25.92,15.51 31.09,15.51 31.5,15.92 33.35,15.92 34.21,16.78 v1(36.99,16.78)
AD9: length 64.2
  Top Layer w0.152: v1(18.09,15.37) 18.08,15.37 U5.66 18.08,8.5 19.83,6.75 22.54,6.75 v1(23.37,5.92) 24,5.29 24,5.26 ; 41.52,10.73 41.52,9.56 v1(41.51,9.56) ; v1(37.6,16.3) 37.6,19.53 34.7,22.43 34.7,24.25
  Bottom Layer w0.152: v1(37.6,16.3) 34.27,16.3 33.56,15.58 31.76,15.58 31.36,15.18 25.24,15.18 25.05,15.37 v1(18.09,15.37) ; v1(23.37,5.92) 24.95,5.92 27.38,8.36 40.31,8.36 v1(41.51,9.56)
AD10: length 36.9
  Top Layer w0.152: 18.54,10.62 18.6,10.57 18.6,8.57 20.04,7.12 23.65,7.12 v1(23.83,6.94) 25.58,5.18 CART1.16 ; v1(37,12.45) 34.77,12.45 34.7,12.37 34.7,11.42 ; v1(34.8,9.43) 34.7,9.53 34.7,11.36 ; 42.52,10.73 42.52,12.42 v1(42.52,12.42)
  Bottom Layer w0.152: v1(37,12.45) 37.02,12.42 v1(42.52,12.42) ; v1(34.8,9.43) 34.55,9.17 26.88,9.17 24.64,6.94 v1(23.83,6.94)
AD11: length 52.4
  Top Layer w0.152: 35.2,24.2 35.2,22.54 v1(40.95,16.79) ; U5.68 19.08,8.64 20.24,7.49 24.85,7.49 v1(26.27,6.08) 27.08,5.26 CART1.17 ; v1(44.25,8.36) 43.52,9.09 U2.42 43.52,14.07 v1(42.95,14.64)
  Bottom Layer w0.152: v1(44.25,8.36) 43.84,7.95 28.15,7.95 v1(26.27,6.08) ; v1(40.95,16.79) 42.95,14.8 v1(42.95,14.64)
AD12: length 62.4
  Top Layer w0.152: 29.7,24.2 29.7,22.33 v1(32.03,20) ; v1(21.03,20.05) 19.58,18.59 19.58,18.54 18.7,17.66 18.7,13.39 19.58,12.5 U5.69 19.58,8.73 20.46,7.85 26.01,7.85 v1(27.79,6.08) 28.58,5.28 CART1.18 ; 45.02,10.73 45.02,8.06 v1(45.01,8.06)
  Bottom Layer w0.152: v1(21.03,20.05) 21.64,19.44 30.55,19.44 31.11,20 v1(32.03,20) ; v1(27.79,6.08) 29.31,7.6 44.55,7.6 v1(45.01,8.06)
AD13: length 63.5
  Top Layer w0.152: v1(36.17,15.79) 36.17,19.74 33.7,22.21 33.7,24.2 ; v1(46.03,7.9) 46.02,7.91 46.02,10.73 ; v1(20.12,13.64) 20.08,13.61 U5.70 20.08,8.8 20.68,8.2 26.99,8.2 v1(29.11,6.08) 30.22,4.96 30.22,4.91
  Bottom Layer w0.152: v1(29.11,6.08) 30.23,7.19 45.32,7.19 v1(46.03,7.9) ; v1(36.17,15.79) 35.16,15.79 34.3,14.93 32.1,14.93 31.67,14.5 27,14.5 26.14,13.64 v1(20.12,13.64)
AD14: length 62.2
  Top Layer w0.152: 30.2,24.2 30.23,24.17 30.23,22.59 33.12,19.7 33.12,16.35 v1(34.07,15.4) ; v1(20.58,14.2) 20.58,14.2 U5.71 ; 47.02,10.73 47.02,7.98 v1(47.04,7.95) ; 31.53,4.76 31.53,5.28 v1(30.58,6.23) 28.27,8.54 20.94,8.54 20.6,8.89 20.6,10.71
  Bottom Layer w0.152: v1(30.58,6.23) 31.14,6.79 45.87,6.79 v1(47.04,7.95) ; v1(34.07,15.4) 33.9,15.24 31.92,15.24 31.51,14.83 26.68,14.83 26.06,14.2 v1(20.58,14.2)
AD15: length 64.6
  Top Layer w0.152: CART1.21 33.08,5.15 v1(31.96,6.28) 29.36,8.88 21.32,8.88 21.08,9.11 U5.72 21.08,13.13 ; 32.2,24.2 32.2,22.3 35.47,19.03 v1(35.47,15.28) ; 48.02,10.73 48.02,8.01 v1(47.04,7.04)
  Bottom Layer w0.152: v1(35.47,15.28) 35.47,15.22 34.86,14.61 32.32,14.61 31.85,14.15 27.31,14.15 26.29,13.14 v1(21.08,13.14) ; v1(31.96,6.28) 46.28,6.28 v1(47.04,7.04)
BK: length 7.5
  Top Layer w0.152: U5.100 27.01,24.8 27.43,25.23 30.43,25.23 30.69,24.97 30.69,24.22 30.7,24.2
FA0: length 45.5
  Top Layer w0.152: U5.26 10.23,24.8 12.14,22.89 v1(12.14,22.48) ; v1(38.03,14.5) 38.01,14.48 38.01,10.72
  Bottom Layer w0.152: v1(12.14,22.48) 12.14,18.57 10.79,17.21 10.79,15.26 13.52,12.53 26.31,12.53 27.63,13.84 32.05,13.84 32.48,14.27 35.18,14.27 35.77,14.86 37.66,14.86 v1(38.03,14.5)
FA1: length 34.6
  Top Layer w0.152: v1(12.91,22.38) 12.58,22.7 U5.21 ; 38.02,30.53 38.02,27.75 v1(37.95,27.69)
  Bottom Layer w0.152: v1(12.91,22.38) 12.91,22.6 15.94,25.63 27.95,25.63 28.39,26.06 30.14,26.06 30.91,26.84 37.32,26.84 37.95,27.47 v1(37.95,27.69)
FA2: length 34.6
  Top Layer w0.152: U5.20 13.08,22.92 v1(13.62,22.38) ; 38.52,30.53 38.52,27.32 v1(38.51,27.3)
  Bottom Layer w0.152: v1(13.62,22.38) 13.62,22.6 16.32,25.3 28.13,25.3 28.55,25.73 30.33,25.73 31.11,26.51 37.7,26.51 38.5,27.3 v1(38.51,27.3)
FA3: length 34.7
  Top Layer w0.152: v1(39.02,26.92) 39.02,30.53 ; U5.19 13.58,23.38 14.33,22.64 v1(14.33,22.38)
  Bottom Layer w0.152: 39.02,26.92 38.27,26.18 31.31,26.18 30.49,25.36 28.77,25.36 28.37,24.97 16.7,24.97 14.33,22.6 v1(14.33,22.38)
FA4: length 34.9
  Top Layer w0.152: U5.18 14.08,23.34 v1(15.04,22.38) ; 39.52,30.53 39.52,26.39 v1(39.5,26.37)
  Bottom Layer w0.152: v1(15.04,22.38) 15.04,22.6 17.07,24.63 28.54,24.63 28.93,25.02 30.67,25.02 31.5,25.85 38.93,25.85 39.45,26.37 v1(39.5,26.37)
FA5: length 35
  Top Layer w0.152: 40.02,30.53 40.02,26.07 v1(40.03,26.06) ; U5.17 14.58,23.55 v1(15.75,22.38)
  Bottom Layer w0.152: v1(15.75,22.38) 15.75,22.6 17.48,24.32 28.71,24.32 29.06,24.68 30.87,24.68 31.7,25.51 39.47,25.51 v1(40.03,26.06)
FA6: length 35
  Top Layer w0.152: v1(40.45,25.54) 40.52,25.61 40.52,30.53 ; U5.16 15.08,23.78 v1(16.48,22.38)
  Bottom Layer w0.152: v1(16.48,22.38) 16.48,22.41 18.08,24.01 28.9,24.01 29.25,24.37 31.08,24.37 31.89,25.18 40.06,25.18 40.42,25.54 v1(40.45,25.54)
FA7: length 35.1
  Top Layer w0.152: v1(17.22,22.38) 15.58,24.02 U5.15 ; v1(40.87,25.04) 41.02,25.19 41.02,30.53
  Bottom Layer w0.152: v1(40.87,25.04) 40.58,24.75 31.99,24.75 31.28,24.04 29.42,24.04 29.06,23.69 18.52,23.69 17.22,22.39 v1(17.22,22.38)
FA8: length 36.4
  Top Layer w0.152: U5.8 19.08,23.51 v1(18.35,22.78) ; v1(46.03,28.43) 46.02,28.44 46.02,30.53
  Bottom Layer w0.152: v1(18.35,22.78) 18.92,23.34 29.21,23.34 29.57,23.7 31.45,23.7 32.13,24.38 42.5,24.38 46.03,27.91 v1(46.03,28.43)
FA9: length 36.4
  Top Layer w0.152: 46.52,30.53 46.52,27.9 v1(46.48,27.87) ; U5.7 19.58,23.29 v1(19.01,22.72)
  Bottom Layer w0.152: v1(19.01,22.72) 19.3,23.01 29.4,23.01 29.74,23.35 31.6,23.35 32.27,24.01 42.75,24.01 46.48,27.74 v1(46.48,27.87)
FA10: length 38.3
  Top Layer w0.152: v1(46.99,27.31) 47.02,27.33 47.02,30.53 ; v1(19.02,22.06) 20.08,23.12 U5.6
  Bottom Layer w0.152: v1(19.02,22.06) 19.6,22.64 29.54,22.64 29.92,23.02 31.79,23.02 32.42,23.66 43.12,23.66 46.78,27.31 v1(46.99,27.31)
FA11: length 38.6
  Top Layer w0.152: U5.5 20.58,22.9 v1(19.64,21.96) ; 47.52,30.53 47.52,26.77 v1(47.5,26.75)
  Bottom Layer w0.152: v1(47.5,26.75) 46.78,26.75 43.31,23.27 32.55,23.27 31.94,22.67 30.05,22.67 29.7,22.31 20,22.31 v1(19.64,21.96)
FA12: length 40.2
  Top Layer w0.152: v1(19.81,21.33) 21.08,22.6 U5.4 ; v1(48.01,26.24) 48.02,26.25 48.02,30.53
  Bottom Layer w0.152: v1(19.81,21.33) 20.42,21.94 29.81,21.94 30.19,22.32 32.15,22.32 32.77,22.94 43.53,22.94 46.83,26.24 v1(48.01,26.24)
FA13: length 40.9
  Top Layer w0.152: U5.3 21.58,22.41 v1(20.6,21.43) ; v1(48.52,25.84) 48.52,30.53
  Bottom Layer w0.152: v1(20.6,21.43) 24.33,21.43 25.25,20.5 29.92,20.5 30.63,21.2 32.72,21.2 33.48,21.96 45.08,21.96 48.52,25.39 v1(48.52,25.84)
FA14: length 41.7
  Top Layer w0.152: v1(49.02,25.28) 49.02,30.52 49.02,30.53 ; U5.2 22.08,22.16 21.14,21.21 v1(21.14,20.76)
  Bottom Layer w0.152: v1(49.02,25.28) 45.38,21.63 33.66,21.63 32.88,20.85 30.83,20.85 30.11,20.14 24.95,20.14 24.34,20.76 21.14,20.76
FA15: length 31.1
  Top Layer w0.152: U5.1 22.58,25.51 22.76,25.33 26.88,25.33 27.13,25.58 29.68,25.58 v1(31.42,27.31) ; v1(49.53,28.94) 49.53,30.51 49.52,30.53
  Bottom Layer w0.152: v1(31.42,27.31) 36.63,27.31 38.25,28.94 v1(49.53,28.94)
LED1: length 13.9
  Top Layer w0.152: U5.35 8.89,20.31 11.09,20.31
  Top Layer w0.203: 15.3,29 15.32,28.99 v1(15.8,28.99)
  Bottom Layer w0.152: v2(11.09,20.3) 11.09,23.16 14.58,26.65 15.5,26.65 15.8,26.95 v1(15.8,28.99)
LED2: length 16.1
  Top Layer w0.152: v2(11.64,19.79) 11.63,19.8 U5.36
  Top Layer w0.203: v1(17.43,28.99) 16.98,28.99 16.96,29
  Bottom Layer w0.152: v1(17.43,28.99) 17.43,26.55 17.02,26.14 14.79,26.14 11.64,22.99 v2(11.64,19.79)
REQ: length 51.2
  Top Layer w0.152: U5.47 8.91,14.27 v1(10.04,14.27) ; v2(48.1,6.04) 48.08,6.02 CART1.31
  Bottom Layer w0.152: v2(48.1,6.04) 47.28,5.22 23.09,5.22 21.55,6.75 9.74,6.75 9.35,7.14 9.35,8.03 9.6,8.28 9.6,13.84 v1(10.04,14.27)
TCK: length 8.2
  Top Layer w0.152: v1(6.71,28.53) 9.91,28.53 11.08,27.35 U5.24
  Bottom Layer w0.152: XP1.5 6.05,29.19 v1(6.71,28.53)
TDI: length 11.2
  Top Layer w0.152: U5.23 11.58,27.41 9.91,29.09 3.81,29.09 3.51,29.39 XP1.3
TDO: length 11.9
  Top Layer w0.152: U5.25 10.58,27.24 9.91,27.92 2.9,27.92 2.24,28.58 XP1.2
TMS: length 10.1
  Top Layer w0.152: XP1.4 4.78,30 5.23,29.54 10.06,29.54 12.08,27.52 U5.22
VMIX: length 43.3
  Top Layer w0.203: v2(32.31,27.97) 33.34,26.94 33.34,26.9 ; 6.18,19.66 5.41,20.44 2.9,20.44 ; 33.34,26.8 31.7,25.16 31.7,24.2 ; 6.26,19.67 v2(7.32,19.67)
  Bottom Layer w0.254: v2(32.31,27.97) 30.84,27.97 29.57,26.7 28.3,26.7 27.74,26.14 19.05,26.14 18.54,26.65 18.54,29.19 18.04,29.7 15.7,29.7 15.14,29.14 15.14,28.07 10.57,23.5 10.57,22.93 v2(7.32,19.67)
~CS2~: length 65.5
  Top Layer w0.152: v1(29.23,13.39) 28.72,13.9 26.93,13.9 25.54,15.28 25.54,18.89 25.13,19.3 U5.89 ; v1(36.13,14.29) 34.2,12.35 34.2,9.21 34.53,8.88 42.8,8.88 46.58,5.09 CART1.30
  Top Layer w0.203: 6.18,18.15 7.29,18.15 v1(7.32,18.18)
  Bottom Layer w0.152: v1(7.32,18.18) 8.54,18.18 10.06,16.66 10.06,15.22 13.22,12.05 26.47,12.05 27.8,13.39 v1(29.23,13.39) 32.15,13.39 32.68,13.92 35.7,13.92 36.08,14.29 v1(36.13,14.29)
~CS~: length 42.5
  Top Layer w0.152: CART1.5 9.08,6.52 v2(10.06,7.5) 10.06,12.63 9.89,12.8 U5.50 ; 38.52,10.73 38.52,9.38 v1(38.51,9.38)
  Bottom Layer w0.152: v1(38.51,9.38) 37.9,8.77 27.08,8.77 24.72,6.41 23.34,6.41 22.25,7.5 v2(10.06,7.5)
~RD~: length 52.9
  Top Layer w0.152: CART1.4 7.57,3.3 7.57,6.57 6.57,7.57 6.57,12.34 7.52,13.29 v1(10.56,13.29) ; v1(39.52,9.63) 39.52,9.64 39.52,10.73 ; 35.2,11.36 35.2,10.5 35.71,9.99 v1(35.71,9.38)
  Bottom Layer w0.152: v1(10.56,13.29) 10.54,13.29 10.02,12.77 10.02,9.12 11.18,7.95 24.95,7.95 26.93,9.94 35.16,9.94 v1(35.71,9.38) 36.22,9.88 39.27,9.88 v1(39.52,9.63)
~WR~: length 68.2
  Top Layer w0.152: v1(34.5,20.7) 33.2,22 33.2,24.2 ; CART1.3 6.08,12.66 7.21,13.79 10.92,13.79 12.04,14.91 12.04,19.23 12.78,18.49 v1(12.89,18.49) ; v1(44.52,20.69) 44.52,30.53
  Bottom Layer w0.152: v1(12.89,18.49) 13.52,19.12 30.8,19.12 31.23,19.54 32.64,19.54 33.81,20.7 v1(34.5,20.7) 44.51,20.7 v1(44.52,20.69)
$1N77583: length 3.3
  Top Layer w0.508: 16.96,30.6 16.92,30.55 13.73,30.55
$1N81263: length 2.3
  Top Layer w0.203: 1.27,19.66 1.33,19.66 2.9,18.09
$1N81264: length 11.6
  Top Layer w0.203: v1(3.96,16.34) 3.94,16.31 3.11,16.31 1.27,18.15
  Bottom Layer w0.406: v1(3.96,16.34) 4.54,16.34 8.28,12.59 v4(8.28,10.29)

## Copper pours and planes (outline as drawn; the poured copper is in the pictures)
GND on Top Layer: -4.06,34.37 58.02,34.37 58.02,-4.49 -4.06,-4.49
GND on Bottom Layer: -3.12,34.1 58.4,34.1 58.4,-4.92 -3.12,-4.92

Small or netless copper shapes (teardrops, artwork), in the pictures only: 409 on Top Layer, 171 on Bottom Layer

## Text on the board
Top Silkscreen Layer: Lite Rev0.1 | Designed by Bread&Firseve | Layout by Mori | TDO | TDI | TMS | TCK | GND | BAT- | BAT+ | VCC | ChisFlash                F32S128V01
